# Altium schematic sheet [03] - MICRO CONTROLLER.SchDoc: SYNCBOX
size A3; Organization: Altium Limited; Address1: L3, 12a Rodborough Rd; Address2: Frenchs Forest; Address3: NSW; Address4: Australia 2086; DocumentNumber: 3; SheetNumber: 3; SheetTotal: 11
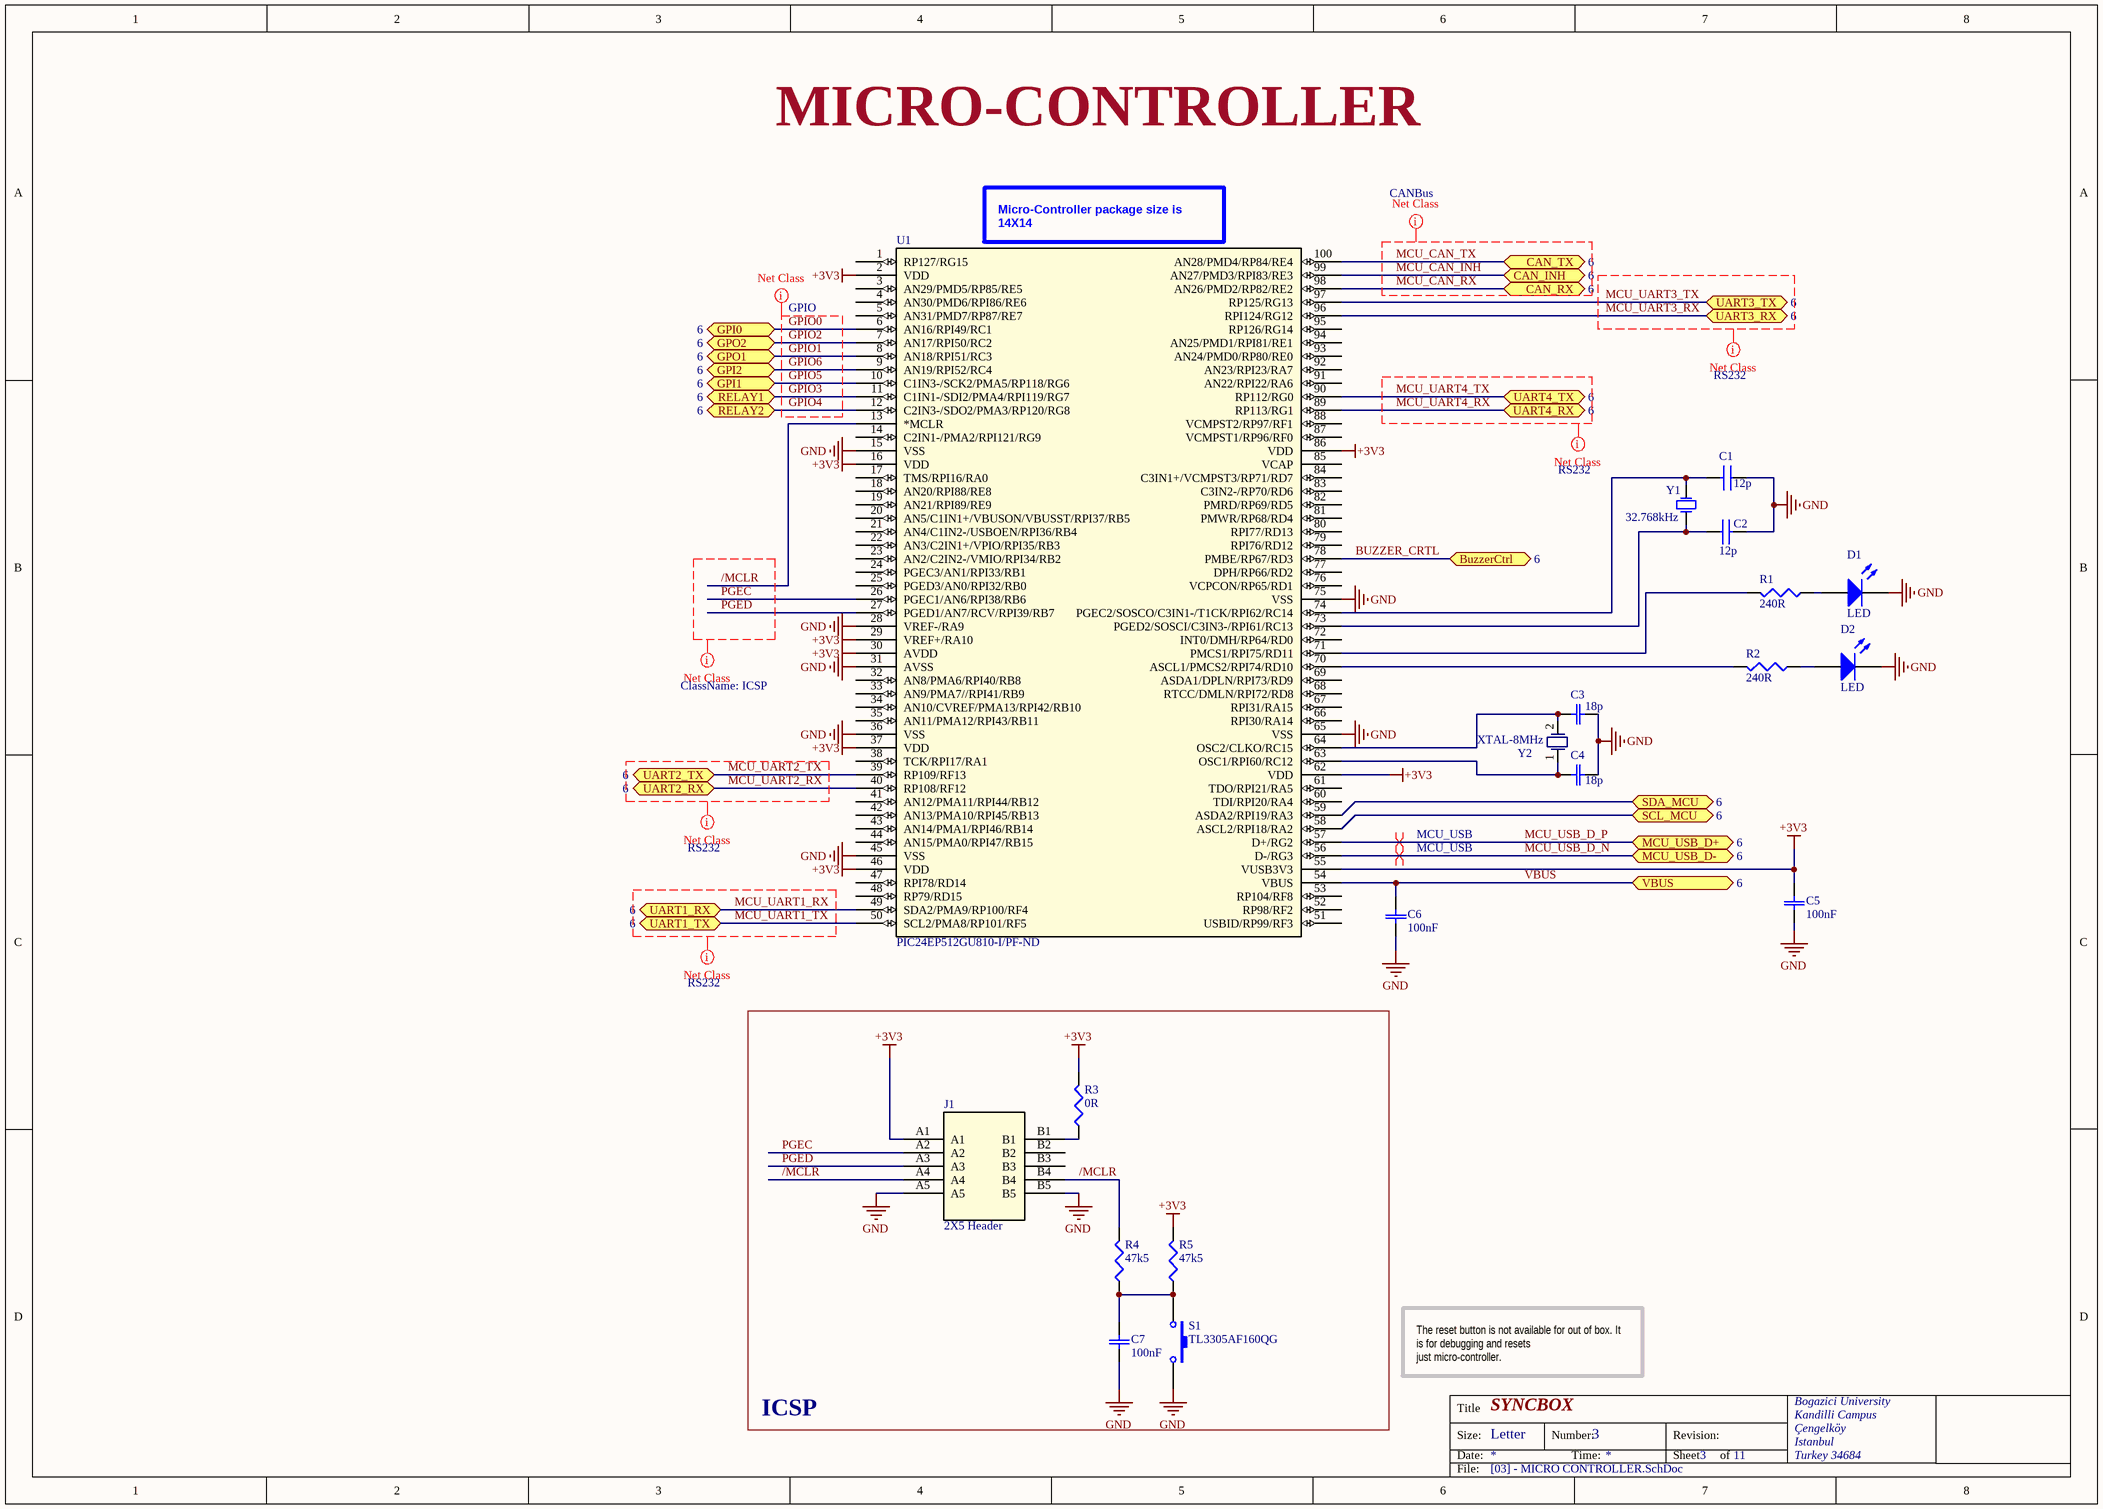
[diagram p0: [03] - MICRO CONTROLLER.SchDoc]

## Parts
C1  12p  [C0402]
C2  12p  [C0402]
C3  18p  [C0402]
C4  18p  [C0402]
C5  100nF  [C0402]
C6  100nF  [C0402]
C7  100nF  [C0402]
D1  LED  [D0603_Directional]
D2  LED  [D0603_Directional]
J1  2X5 Header  [10 Pins]
R1  240R  [R0402]
R2  240R  [R0402]
R3  0R  [R0402]
R4  47k5  [R0402]
R5  47k5  [R0402]
S1  TL3305AF160QG  [TactileSW_SMD]
U1  PIC24EP512GU810-I/PF-ND  [TQFP100_14x14MC]
Y1  32.768kHz  [XTAL-1.1mm]
Y2  XTAL-8MHz  [HC49/US]

## Blocks framed on the sheet
ICSP: C7 J1 R3-R5 S1

## Ports
BuzzerCtrl (bidir, see 6), CAN_INH (bidir, see 6), CAN_RX (bidir, see 6), CAN_TX (bidir, see 6), GPI0 (bidir, see 6), GPI1 (bidir, see 6), GPI2 (bidir, see 6), GPO1 (bidir, see 6), GPO2 (bidir, see 6), MCU_USB_D+ (bidir, see 6), MCU_USB_D- (bidir, see 6), RELAY1 (bidir, see 6), RELAY2 (bidir, see 6), SCL_MCU (bidir, see 6), SDA_MCU (bidir, see 6), UART1_RX (bidir, see 6), UART1_TX (bidir, see 6), UART2_RX (bidir, see 6), UART2_TX (bidir, see 6), UART3_RX (bidir, see 6), UART3_TX (bidir, see 6), UART4_RX (bidir, see 6), UART4_TX (bidir, see 6), VBUS (see 6)

## Nets
+3V3: C5.2 J1.A1 R3.2 R5.2 U1.2(VDD) U1.16(VDD) U1.29(VREF+/RA10) U1.30(AVDD) U1.37(VDD) U1.46(VDD) U1.55(VUSB3V3) U1.62(VDD) U1.86(VDD)
GND: C1.1 C2.2 C3.1 C4.1 C5.1 C6.1 C7.1 D1.2(K) D2.2(K) J1.A5 J1.B5 S1.2 U1.15(VSS) U1.28(VREF-/RA9) U1.31(AVSS) U1.36(VSS) U1.45(VSS) U1.65(VSS) U1.75(VSS)
/MCLR: J1.A4 J1.B4 R4.2 U1.13(*MCLR)
BUZZER_CRTL: U1.78(PMBE/RP67/RD3) ; port BuzzerCtrl
GPIO0: U1.6(AN16/RPI49/RC1) ; port GPI0
GPIO1: U1.8(AN18/RPI51/RC3) ; port GPO1
GPIO2: U1.7(AN17/RPI50/RC2) ; port GPO2
GPIO3: U1.11(C1IN1-/SDI2/PMA4/RPI119/RG7) ; port RELAY1
GPIO4: U1.12(C2IN3-/SDO2/PMA3/RP120/RG8) ; port RELAY2
GPIO5: U1.10(C1IN3-/SCK2/PMA5/RP118/RG6) ; port GPI1
GPIO6: U1.9(AN19/RPI52/RC4) ; port GPI2
MCU_CAN_INH: U1.99(AN27/PMD3/RPI83/RE3) ; port CAN_INH
MCU_CAN_RX: U1.98(AN26/PMD2/RP82/RE2) ; port CAN_RX
MCU_CAN_TX: U1.100(AN28/PMD4/RP84/RE4) ; port CAN_TX
MCU_UART1_RX: U1.49(SDA2/PMA9/RP100/RF4) ; port UART1_RX
MCU_UART1_TX: U1.50(SCL2/PMA8/RP101/RF5) ; port UART1_TX
MCU_UART2_RX: U1.40(RP108/RF12) ; port UART2_RX
MCU_UART2_TX: U1.39(RP109/RF13) ; port UART2_TX
MCU_UART3_RX: U1.96(RPI124/RG12) ; port UART3_RX
MCU_UART3_TX: U1.97(RP125/RG13) ; port UART3_TX
MCU_UART4_RX: U1.89(RP113/RG1) ; port UART4_RX
MCU_UART4_TX: U1.90(RP112/RG0) ; port UART4_TX
MCU_USB_D_N: U1.56(D-/RG3) ; port MCU_USB_D-
MCU_USB_D_P: U1.57(D+/RG2) ; port MCU_USB_D+
PGEC: J1.A2 U1.26(PGEC1/AN6/RPI38/RB6)
PGED: J1.A3 U1.27(PGED1/AN7/RCV/RPI39/RB7)
SCL_MCU: U1.58(ASCL2/RPI18/RA2) ; port SCL_MCU
SDA_MCU: U1.59(ASDA2/RPI19/RA3) ; port SDA_MCU
VBUS: C6.2 U1.54(VBUS) ; port VBUS
NetC1_2: C1.2 U1.74(PGEC2/SOSCO/C3IN1-/T1CK/RPI62/RC14) Y1.2(OSC2)
NetC2_1: C2.1 U1.73(PGED2/SOSCI/C3IN3-/RPI61/RC13) Y1.1(OSC1)
NetC3_2: C3.2 U1.64(OSC2/CLKO/RC15) Y2.2
NetC4_2: C4.2 U1.63(OSC1/RPI60/RC12) Y2.1
NetC7_2: C7.2 R4.1 R5.1 S1.1
NetD1_1: D1.1(A) R1.1
NetD2_1: D2.1(A) R2.1
NetJ1_B1: J1.B1 R3.1
NetR1_2: R1.2 U1.71(PMCS1/RPI75/RD11)
NetR2_2: R2.2 U1.70(ASCL1/PMCS2/RPI74/RD10)

Not connected (* = marked no-connect by the designer): J1 B2 B3; U1 1(RP127/RG15) 3(AN29/PMD5/RP85/RE5) 4(AN30/PMD6/RPI86/RE6) 5(AN31/PMD7/RP87/RE7) 14(C2IN1-/PMA2/RPI121/RG9) 17(TMS/RPI16/RA0) 18(AN20/RPI88/RE8) 19(AN21/RPI89/RE9) 20(AN5/C1IN1+/VBUSON/VBUSST/RPI37/RB5) 21(AN4/C1IN2-/USBOEN/RPI36/RB4) 22(AN3/C2IN1+/VPIO/RPI35/RB3) 23(AN2/C2IN2-/VMIO/RPI34/RB2) 24(PGEC3/AN1/RPI33/RB1) 25(PGED3/AN0/RPI32/RB0) 32(AN8/PMA6/RPI40/RB8) 33(AN9/PMA7//RPI41/RB9) 34(AN10/CVREF/PMA13/RPI42/RB10) 35(AN11/PMA12/RPI43/RB11) 38(TCK/RPI17/RA1) 41(AN12/PMA11/RPI44/RB12) 42(AN13/PMA10/RPI45/RB13) 43(AN14/PMA1/RPI46/RB14) 44(AN15/PMA0/RPI47/RB15) 47(RPI78/RD14) 48(RP79/RD15) 51(USBID/RP99/RF3) 52(RP98/RF2) 53(RP104/RF8) 60(TDI/RPI20/RA4) 61(TDO/RPI21/RA5) 66(RPI30/RA14) 67(RPI31/RA15) 68(RTCC/DMLN/RPI72/RD8) 69(ASDA1/DPLN/RPI73/RD9) 72(INT0/DMH/RP64/RD0) 76(VCPCON/RP65/RD1) 77(DPH/RP66/RD2) 79(RPI76/RD12) 80(RPI77/RD13) 81(PMWR/RP68/RD4) 82(PMRD/RP69/RD5) 83(C3IN2-/RP70/RD6) 84(C3IN1+/VCMPST3/RP71/RD7) 85(VCAP) 87(VCMPST1/RP96/RF0) 88(VCMPST2/RP97/RF1) 91(AN22/RPI22/RA6) 92(AN23/RPI23/RA7) 93(AN24/PMD0/RP80/RE0) 94(AN25/PMD1/RPI81/RE1) 95(RP126/RG14)

## Layout directives
net class ICSP: /MCLR, PGEC, PGED
net class CANBus: MCU_CAN_INH, MCU_CAN_RX, MCU_CAN_TX
net class RS232: MCU_UART1_RX, MCU_UART1_TX, MCU_UART2_RX, MCU_UART2_TX, MCU_UART3_RX, MCU_UART3_TX, MCU_UART4_RX, MCU_UART4_TX
differential pair; net class MCU_USB: MCU_USB_D_N, MCU_USB_D_P
net class GPIO: GPIO0, GPIO1, GPIO2, GPIO3, GPIO4, GPIO5, GPIO6

## Notes on the sheet
- MICRO-CONTROLLER
- (near U1) Micro-Controller package size is 14X14
- The reset button is not available for out of box. It is for debugging and resets
  just micro-controller.
- Title
- Size:
- Date:
- Letter
- Number:
- Time:
- Revision:
- Sheet
- of
- Bogazici University
- Kandilli Campus
- Çengelköy
- Istanbul
- Turkey 34684
- File:

## Library data of the parts
C1 C2 = CL05C120JB5NNNC: CAP CER 12PF 50V C0G 5% 0402; Manufacturer Part Number: CL05C120JB5NNNC; Supplier Part Number: 1276-1178-1-ND
C3 C4 = CL05C180JB5NNNC: CAP CER 18PF 50V C0G/NP0 0402; Manufacturer 1: Samsung Electro-Mechanics; Tolerance: ±5%; Temperature Coefficient: C0G, NP0; Notification: Current market demand for these product types have resulted in fluctuating and extending lead times. Lead times may differ.; Manufacturer Part Number 1: CL05C180JB5NNNC; RoHS: RoHS Compliant; Stock 1: 89300; Pricing 1: 1=0.1, 10=0.034, 100=0.0154, 500=0.01114, 1000=0.00888, 2500=0.00814, 5000=0.00753 (USD); Packaging: Cut Tape (CT); Part Status: Active; Voltage - Rated: 50V; Operating Temperature: -55°C ~ 125°C; Features: -; Ratings: -; Applications: General Purpose; Mounting Type: Surface Mount, MLCC; Package / Case: 0402 (1005 Metric); Size / Dimension: 0.039" L x 0.020" W (1.00mm x 0.50mm); Height - Seated (Max): -; Thickness (Max): 0.022" (0.55mm); Lead Spacing: -; Lead Style: -; ComponentLink1URL: http://www.samsungsem.com/kr/support/product-search/mlcc/CL05C180JB5NNNC.jsp; ComponentLink1Description: http://www.samsungsem.com/kr/support/product-search/mlcc/CL05C180JB5NNNC.jsp; Supplier 1: Digi-Key; Supplier Part Number 1: 1276-1140-1-ND; Description 1: CAP CER 18PF 50V C0G/NP0 0402; Category: Capacitors
C5 C7 = CL05A104KA5NNNC: CAP CER 0.1UF 50V X8R 0603; Manufacturer 1: Samsung Electro-Mechanics; Voltage - Rated: 25V; Tolerance: ±10%; Temperature Coefficient: X5R; Notification: Current market demand for these product types have resulted in fluctuating and extending lead times. Lead times may differ.; Description 1: CAP CER 0.1UF 25V X5R 0402; Category: Capacitors; Operating Temperature: -55°C ~ 85°C; Package / Case: 0402 (1005 Metric); Supplier 1: Digi-Key; Supplier Part Number 1: 1276-1043-6-ND; RoHS: RoHS Compliant; Stock 1: 100000; Pricing 1: 1=0.1, 10=0.04, 100=0.0176, 500=0.0126, 1000=0.0099, 2500=0.009, 5000=0.00828 (USD); Mounting Type: Surface Mount, MLCC; Applications: General Purpose; Ratings: -; Size / Dimension: 0.039" L x 0.020" W (1.00mm x 0.50mm); Height - Seated (Max): -; Thickness (Max): 0.022" (0.55mm); Lead Spacing: -; Features: -; Packaging: Digi-Reel®; Lead Style: -; ComponentLink1URL: http://www.samsungsem.com/kr/support/product-search/mlcc/CL05A104KA5NNNC.jsp; ComponentLink1Description: http://www.samsungsem.com/kr/support/product-search/mlcc/CL05A104KA5NNNC.jsp; Manufacturer Part Number 1: CL05A104KA5NNNC; Part Status: Active
C6 = CL05A104KA5NNNC: CAP CER 0.1UF 25V X5R 0402; Manufacturer 1: Samsung Electro-Mechanics; Tolerance: ±10%; Notification: Current market demand for these product types have resulted in fluctuating and extending lead times. Lead times may differ.; .Checked SCH: CHK; Category: Capacitors; Operating Temperature: -55°C ~ 85°C; Package / Case: 0402 (1005 Metric); Voltage - Rated: 25V; Supplier 1: Digi-Key; Supplier Part Number 1: 1276-1043-6-ND; RoHS: RoHS Compliant; Stock 1: 100000; Pricing 1: 1=0.1, 10=0.04, 100=0.0176, 500=0.0126, 1000=0.0099, 2500=0.009, 5000=0.00828 (USD); Temperature Coefficient: X5R; Mounting Type: Surface Mount, MLCC; Applications: General Purpose; Ratings: -; Size / Dimension: 0.039" L x 0.020" W (1.00mm x 0.50mm); Height - Seated (Max): -; Thickness (Max): 0.022" (0.55mm); Lead Spacing: -; Features: -; Packaging: Digi-Reel®; Lead Style: -; ComponentLink1URL: http://www.samsungsem.com/kr/support/product-search/mlcc/CL05A104KA5NNNC.jsp; ComponentLink1Description: http://www.samsungsem.com/kr/support/product-search/mlcc/CL05A104KA5NNNC.jsp; Manufacturer Part Number 1: CL05A104KA5NNNC; Part Status: Active; Description 1: CAP CER 0.1UF 25V X5R 0402
D1 D2 = LS Q976-NR-1: LED RED DIFFUSED 0603 SMD; Manufacturer 1: OSRAM Opto Semiconductors Inc.; Lens Color: White; Millicandela Rating: 104mcd; Lens Style/Size: Rectangle with Flat Top, 1.00mm x 0.80mm; Voltage - Forward (Vf) (Typ): 2V; Current - Test: 20mA; Viewing Angle: 160°; Wavelength - Dominant: 633nm; Wavelength - Peak: 645nm; Published: 8-Jun-2000; LatestRevisionDate: 08-Jul-2005; LatestRevisionNote: Mech Layer 1 removed.; PackageReference: LED-0; Publisher: Altium Limited; PackageDescription: LED; 2 Leads; Supplier 1: Digi-Key; Supplier Part Number 1: 475-2512-1-ND; Manufacturer Part Number 1: LS Q976-NR-1; RoHS: RoHS Compliant; Description 1: LED RED DIFFUSED 0603 SMD; Category: Optoelectronics; Stock 1: 127302; Pricing 1: 1=0.38, 10=0.274, 25=0.202, 100=0.1444, 250=0.0982, 500=0.08664, 1000=0.06787 (USD); Packaging: Cut Tape (CT); Part Status: Active; Color: Red; Lens Transparency: Diffused; Mounting Type: Surface Mount; Features: -; Package / Case: 0603 (1608 Metric); Supplier Device Package: 0603; Size / Dimension: 1.60mm L x 0.80mm W; Height (Max): 0.80mm; ComponentLink1URL: https://dammedia.osram.info/media/resource/hires/osram-dam-2493499/LS%20Q976.pdf; ComponentLink1Description: https://dammedia.osram.info/media/resource/hires/osram-dam-2493499/LS%20Q976.pdf
J1 = 67997-410HLF: CONN HEADER 10POS .100 STR TIN; pin to pad: A1>1 A2>3 A3>5 A4>7 A5>9 B1>2 B2>4 B3>6 B4>8 B5>10; Vendor: Amphenol FCI; Built_By: EMA_UL_Team; C: Copyright (C) 2015 Accelerated Designs. All rights reserved; Pitch - Mating: 0.100" (2.54mm); Number of Positions: 10; Number of Positions Loaded: All; Style: Board to Board; Shrouding: Unshrouded; Contact Length - Mating: 0.230" (5.84mm); Contact Length - Post: 0.120" (3.05mm); Overall Contact Length: 0.450" (11.43mm); Material Flammability Rating: UL94 V-0; Manufacturer_Part_Number: 67997-410HLF; RefDes: RefDes; Type: DEV; Value: Value; Manufacturer 1: Amphenol FCI; Manufacturer Part Number 1: 67997-410HLF; RoHS: RoHS Compliant; Stock 1: 36400; Pricing 1: 1=0.27, 10=0.259, 100=0.1811, 500=0.1552, 1000=0.12933, 5000=0.11085, 10000=0.10346 (USD); Packaging: Bulk; Part Status: Active; Connector Type: Header; Contact Type: Male Pin; Number of Rows: 2; Row Spacing - Mating: 0.100" (2.54mm); Mounting Type: Through Hole; Termination: Solder; Fastening Type: Push-Pull; Insulation Height: 0.100" (2.54mm); Contact Shape: Square; Contact Finish - Mating: Tin; Contact Finish Thickness - Mating: 100.0µin (2.54µm); Contact Finish - Post: Tin; Contact Material: Phosphor Bronze; Insulation Material: -; Features: -; Operating Temperature: -; Ingress Protection: -; Insulation Color: Black; Current Rating: -; Voltage Rating: -; Mated Stacking Heights: -; Contact Finish Thickness - Post: -; Applications: -; ComponentLink1URL: https://cdn.amphenol-icc.com/media/wysiwyg/files/drawing/67996.pdf; ComponentLink1Description: https://cdn.amphenol-icc.com/media/wysiwyg/files/drawing/67996.pdf; Supplier 1: Digi-Key; Supplier Part Number 1: 609-3243-ND; Description 1: CONN HEADER 10POS .100 STR TIN; Category: Connectors, Interconnects
R1 R2 = RMCF0402FT240R: RES TF 240 OHM 1% 0.0625W 0402; Manufacturer: Stackpole Electronics Inc; Resistance (Ohms): 240; Power (Watts): 0.063W, 1/16W; Temperature Coefficient: ±100ppm/°C; Category: Resistors; Supplier Part Number: RMCF0402FT240RCT-ND; Manufacturer Part Number: RMCF0402FT240R; Package / Case: 0402 (1005 Metric); Price 1k [$]: 0.00384; Tolerance: ±1%; Value: 240R; Supplier: Digikey; Supplier 1: Digi-Key; Supplier Part Number 1: RMCF0402FT240RCT-ND; RoHS: RoHS Compliant; Stock 1: 39860; Pricing 1: 1=0.04, 10=0.025, 50=0.0138, 100=0.0105, 250=0.0078, 500=0.00576, 1000=0.00384 (USD); Composition: Thick Film; Features: -; Size / Dimension: 0.039" L x 0.020" W (1.00mm x 0.50mm); Height: 0.016" (0.40mm); Number of Terminations: 2; Packaging: Cut Tape (CT); ComponentLink1URL: http://www.seielect.com/Catalog/SEI-RMCF.pdf; ComponentLink1Description: http://www.seielect.com/Catalog/SEI-RMCF.pdf
R3 = RC1005J000CS: RES SMD 0 OHM JUMPER 1/16W 0402; Manufacturer 1: Samsung Electro-Mechanics; Power (Watts): 0.063W, 1/16W; Category: Resistors; Package / Case: 0402 (1005 Metric); Tolerance: Jumper; Supplier 1: Digi-Key; Supplier Part Number 1: 1276-3480-6-ND; RoHS: RoHS Compliant; Stock 1: 9624698; Pricing 1: 1=0.1, 10=0.016, 25=0.0116, 50=0.009, 100=0.0066, 250=0.005, 500=0.004, 1000=0.00295, 5000=0.00211 (USD); Composition: Thick Film; Features: Moisture Resistant; Temperature Coefficient: -; Size / Dimension: 0.039" L x 0.020" W (1.00mm x 0.50mm); Packaging: Digi-Reel®; ComponentLink1URL: http://www.samsungsem.com/kr/support/product-search/chip-resistor/RC1005J000CS.jsp; ComponentLink1Description: http://www.samsungsem.com/kr/support/product-search/chip-resistor/RC1005J000CS.jsp; Manufacturer Part Number 1: RC1005J000CS; Part Status: Active; Operating Temperature: -55°C ~ 155°C; Supplier Device Package: 0402; Height - Seated (Max): 0.016" (0.40mm); Failure Rate: -; Description 1: RES SMD 0 OHM JUMPER 1/16W 0402
R4 R5 = RC0402FR-0747K5L: RES 47.5K OHM 1/16W 1% 0402 SMD; Manufacturer: Yageo; Power (Watts): 0.063W, 1/16W; Temperature Coefficient: ±100ppm/°C; Supplier 1: Digi-Key; Supplier Part Number 1: 311-47.5KLRCT-ND; Manufacturer Part Number: RC0402FR-0747K5L; RoHS: RoHS Compliant; Category: Resistors; Stock 1: 59607; Pricing 1: 10=0.014, 100=0.0063, 500=0.00382, 1000=0.0027, 5000=0.00203 (USD); Resistance (Ohms): 47.5K; Composition: Thick Film; Features: -; Tolerance: ±1%; Package / Case: 0402 (1005 Metric); Size / Dimension: 0.039" L x 0.020" W (1.00mm x 0.50mm); Height: 0.016" (0.40mm); Number of Terminations: 2; Packaging: Cut Tape (CT); ComponentLink1URL: http://www.yageo.com/documents/recent/PYu-RC0402_51_RoHS_L_6.pdf; ComponentLink1Description: http://www.yageo.com/documents/recent/PYu-RC0402_51_RoHS_L_6.pdf
S1 = TL3305AF160QG: SWITCH TACTILE SPST-NO 50MA 12V; Manufacturer 1: E-Switch; Switch Function: Off-Mom; Contact Rating @ Voltage: 0.05A @ 12VDC; Actuator Type: Standard; Actuator Height off PCB, Vertical: 3.80mm; Actuator Orientation: Top Actuated; Outline: 4.50mm x 4.50mm; Illumination: Non-Illuminated; Operating Force: 160gf; Switch Travel: 0.20mm; Mechanical Life: 500,000 Cycles; Supplier 1: Digi-Key; Supplier Part Number 1: EG5350CT-ND; Manufacturer Part Number 1: TL3305AF160QG; RoHS: RoHS Compliant; Description 1: SWITCH TACTILE SPST-NO 50MA 12V; Category: Switches; Stock 1: 46397; Pricing 1: 1=0.22, 10=0.217, 25=0.2096, 50=0.202, 100=0.1907, 250=0.17952, 500=0.17204, 1000=0.1309 (USD); Packaging: Cut Tape (CT); Part Status: Active; Circuit: SPST-NO; Mounting Type: Surface Mount; Actuator Length, Right Angle: -; Termination Style: Gull Wing; Illumination Type, Color: -; Illumination Voltage (Nominal): -; Ingress Protection: -; Features: -; Operating Temperature: -20°C ~ 70°C; Actuator Material: -; ComponentLink1URL: http://spec_sheets.e-switch.com/specs/P010468.pdf; ComponentLink1Description: http://spec_sheets.e-switch.com/specs/P010468.pdf
U1 = PIC24EP512GU810-: IC MCU 16BIT 512KB FLASH 100TQFP; Manufacturer_Part_Number: PIC24EP512GU810-I/PT; Manufacturer 1: Microchip Technology; Vendor: Microchip; Built_By: EMA_UL_Team; C: Copyright (C) 2015 Accelerated Designs. All rights reserved; Core Processor: PIC; Core Size: 16-Bit; Speed: 60 MIPs; Connectivity: CANbus, I²C, IrDA, LINbus, SPI, UART/USART, USB OTG; Peripherals: Brown-out Detect/Reset, DMA, POR, PWM, WDT; Program Memory Size: 512KB (170K x 24); RAM Size: 24K x 16; Voltage - Supply (Vcc/Vdd): 3 V ~ 3.6 V; Data Converters: A/D 32x10b/12b; Oscillator Type: Internal; RefDes: RefDes; Type: Type; Value: Value; Supplier 1: Digi-Key; Supplier Part Number 1: PIC24EP512GU810-I/PF-ND; Manufacturer Part Number 1: PIC24EP512GU810-I/PF; RoHS: RoHS Compliant; Description 1: IC MCU 16BIT 512KB FLASH 100TQFP; Category: Integrated Circuits (ICs); Stock 1: 5419; Pricing 1: 1=9.23, 25=8.4668 (USD); Packaging: Tray; Part Status: Active; Program Memory Type: FLASH; EEPROM Size: -; Operating Temperature: -40°C ~ 85°C (TA); Package / Case: 100-TQFP; Supplier Device Package: 100-TQFP (14x14); Base Part Number: PIC24EP512GU810; ComponentLink1URL: http://www.microchip.com/mymicrochip/filehandler.aspx?ddocname=en554454; ComponentLink1Description: http://www.microchip.com/mymicrochip/filehandler.aspx?ddocname=en554454
Y1 = XTAL_32.768kHz: 32768 Hz RTC Crystal; Manufacturer Part Number: AB38T-32.768KHZ; Digikey P/N: 535-9034-ND
Y2 = Crystal-8MHz: 8MHz ±30ppm Crystal 18pF 80 Ohm -20°C ~ 70°C  Surface Mount HC49/US; Brand: ABRACON; Case Height: 4.2 mm; Case Length: 11.4 mm; Case Width: 4.7 mm; ESR: 80 Ohms; Frequency Stability: 50 PPM; Manufacturer 2: ABRACON; Manufacturer Part Number 2: ABLS-8.000MHZ-B4-T; Stock 2: 7825; Dimensions: 4.7 mm W x 11.4 mm L x 4.2 mm H; Frequency: 8 MHz; Load Capacitance: 18 pF; Package / Case: HC-49/US; Operating Temperature Range: - 20 C to + 70 C; Mounting Style: SMD/SMT; Factory Pack Quantity: 1000; Product Category: Crystals; RoHS: Details; Tolerance: 30 PPM; Termination Style: SMD/SMT; Packaging: Reel; Series: ABLS; Type: Low Profile Microprocessor Crystal; ComponentLink1URL: https://abracon.com/Support/PackageDrawing/Resonators/ABLS-2D.pdf; ComponentLink1Description: https://abracon.com/Support/PackageDrawing/Resonators/ABLS-2D.pdf; ComponentLink2URL: http://www.abracon.com/Support/PackageDrawing/Resonators/ABLS-2D.pdf; ComponentLink2Description: http://www.abracon.com/Support/PackageDrawing/Resonators/ABLS-2D.pdf; Supplier 1: Digi-Key; Supplier Part Number 1: 535-10212-1-ND; Supplier 2: RSComponents; Supplier Part Number 2: 1710238; Description 2: 8MHz ±30ppm Crystal 18pF 80 Ohm -20°C ~ 70°C  Surface Mount HC49/US